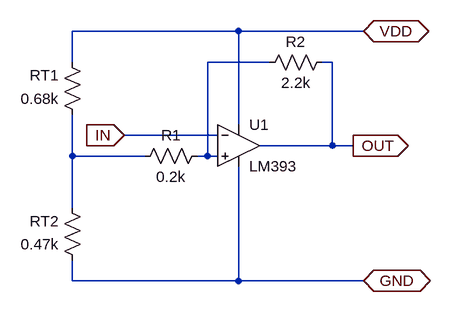
[diagram p0: schematic AD_converter.asc]
AD_converter.asc, the LTspice schematic file:
Version 4
SHEET 1 880 748
WIRE 448 304 192 304
WIRE 640 304 448 304
WIRE 192 352 192 304
WIRE 496 352 400 352
WIRE 592 352 576 352
WIRE 448 448 448 304
WIRE 416 464 272 464
WIRE 592 480 592 352
WIRE 592 480 480 480
WIRE 624 480 592 480
WIRE 192 496 192 432
WIRE 304 496 192 496
WIRE 400 496 400 352
WIRE 400 496 384 496
WIRE 416 496 400 496
WIRE 192 576 192 496
WIRE 192 688 192 656
WIRE 448 688 448 512
WIRE 448 688 192 688
WIRE 640 688 448 688
FLAG 640 304 VDD
IOPIN 640 304 BiDir
FLAG 624 480 OUT
IOPIN 624 480 Out
FLAG 272 464 IN
IOPIN 272 464 In
FLAG 640 688 GND
IOPIN 640 688 BiDir
SYMBOL LM393 448 416 R0
SYMATTR InstName U1
SYMBOL res 400 480 R90
WINDOW 0 0 56 VBottom 2
WINDOW 3 32 56 VTop 2
SYMATTR InstName R1
SYMATTR Value 0.2k
SYMBOL res 592 336 R90
WINDOW 0 0 56 VBottom 2
WINDOW 3 32 56 VTop 2
SYMATTR InstName R2
SYMATTR Value 2.2k
SYMBOL res 208 448 R180
WINDOW 0 36 76 Left 2
WINDOW 3 36 40 Left 2
SYMATTR InstName RT1
SYMATTR Value 0.68k
SYMBOL res 208 672 R180
WINDOW 0 36 76 Left 2
WINDOW 3 36 40 Left 2
SYMATTR InstName RT2
SYMATTR Value 0.47k

The netlist it stands for:
* AD_converter.asc
* U1: LM393 (symbol LM393 not available, pins judged from their places): In+=N001 In-=IN V+=VDD V-=GND OUT=OUT
R1 N001 N002 0.2k
R2 OUT N001 2.2k
RT1 N002 VDD 0.68k
RT2 GND N002 0.47k
.backanno
.end